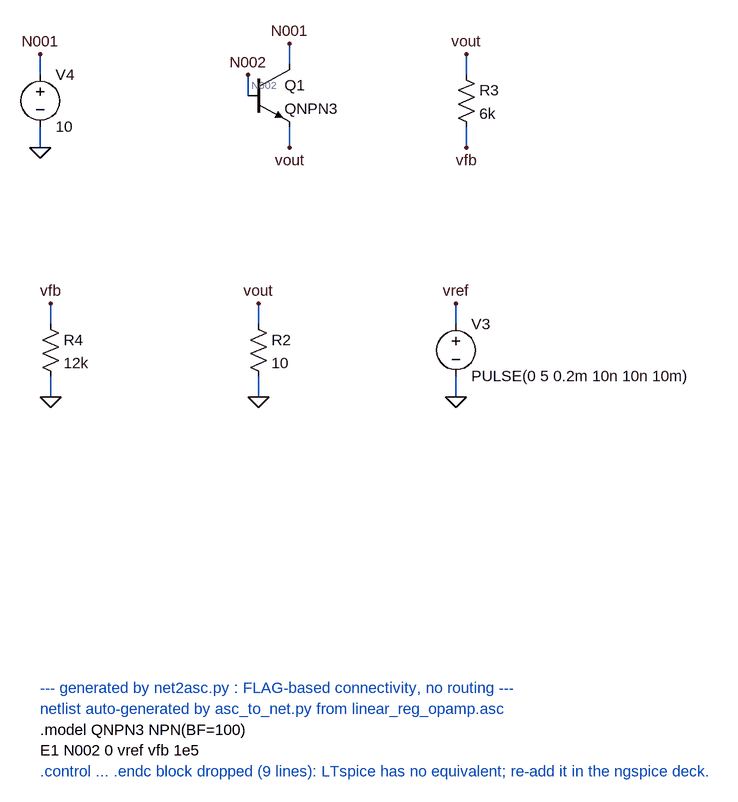
[diagram p0: schematic linear_reg_opamp.asc]
linear_reg_opamp.asc, the LTspice schematic file:
Version 4
SHEET 1 1056 1288
WIRE 0 16 0 -16
WIRE 0 96 0 128
WIRE 384 0 384 -32
WIRE 320 48 320 16
WIRE 384 96 384 128
WIRE 656 16 656 -16
WIRE 656 96 656 128
WIRE 16 400 16 368
WIRE 16 480 16 512
WIRE 336 400 336 368
WIRE 336 480 336 512
WIRE 640 400 640 368
WIRE 640 480 640 512
FLAG 0 -16 N001
FLAG 0 128 0
FLAG 384 -32 N001
FLAG 320 16 N002
FLAG 384 128 vout
FLAG 656 -16 vout
FLAG 656 128 vfb
FLAG 16 368 vfb
FLAG 16 512 0
FLAG 336 368 vout
FLAG 336 512 0
FLAG 640 368 vref
FLAG 640 512 0
SYMBOL voltage 0 0 R0
SYMATTR InstName V4
SYMATTR Value 10
SYMBOL npn 320 0 R0
SYMATTR InstName Q1
SYMATTR Value QNPN3
SYMBOL res 640 0 R0
SYMATTR InstName R3
SYMATTR Value 6k
SYMBOL res 0 384 R0
SYMATTR InstName R4
SYMATTR Value 12k
SYMBOL res 320 384 R0
SYMATTR InstName R2
SYMATTR Value 10
SYMBOL voltage 640 384 R0
SYMATTR InstName V3
SYMATTR Value PULSE(0 5 0.2m 10n 10n 10m)
TEXT 0 960 Left 2 ;--- generated by net2asc.py : FLAG-based connectivity, no routing ---
TEXT 0 992 Left 2 ;netlist auto-generated by asc_to_net.py from linear_reg_opamp.asc
TEXT 0 1024 Left 2 !.model QNPN3 NPN(BF=100)
TEXT 0 1056 Left 2 !E1 N002 0 vref vfb 1e5
TEXT 0 1088 Left 2 ;.control ... .endc block dropped (9 lines): LTspice has no equivalent; re-add it in the ngspice deck.

The netlist it stands for:
* linear_reg_opamp.asc
V4 N001 0 10
Q1 N001 N002 vout 0 QNPN3
R3 vout vfb 6k
R4 vfb 0 12k
R2 vout 0 10
V3 vref 0 PULSE(0 5 0.2m 10n 10n 10m)
.model NPN NPN
.model PNP PNP
.lib standard.bjt
* --- generated by net2asc.py : FLAG-based connectivity, no routing ---
* netlist auto-generated by asc_to_net.py from linear_reg_opamp.asc
.model QNPN3 NPN(BF=100)
E1 N002 0 vref vfb 1e5
* .control ... .endc block dropped (9 lines): LTspice has no equivalent; re-add it in the ngspice deck.
.backanno
.end